# EAGLE design M_F_ext_breadboard (EAGLE 9.6.2)
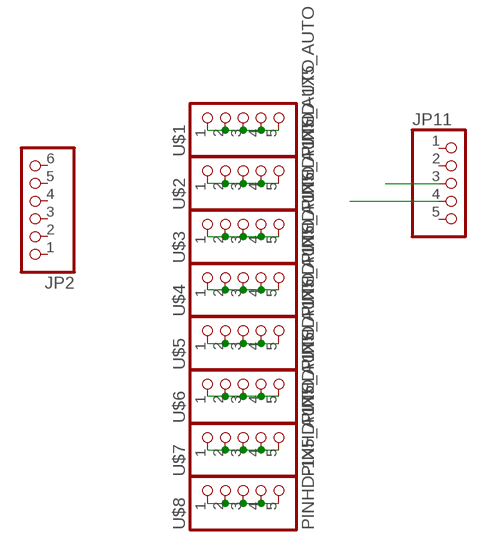
[diagram p0: schematic, sheet 1]

## Parts
JP2  PINHD-1X6  [1X06]
JP11  PINHD-1X5  [1X05]
U$1  PINHD-1X5_AUTO  [1X5_AUTO]
U$2  PINHD-1X5_AUTO  [1X5_AUTO]
U$3  PINHD-1X5_AUTO  [1X5_AUTO]
U$4  PINHD-1X5_AUTO  [1X5_AUTO]
U$5  PINHD-1X5_AUTO  [1X5_AUTO]
U$6  PINHD-1X5_AUTO  [1X5_AUTO]
U$7  PINHD-1X5_AUTO  [1X5_AUTO]
U$8  PINHD-1X5_AUTO  [1X5_AUTO]

## Nets
GND: JP11.4
N$1: U$1.1 U$1.2 U$1.3 U$1.4 U$1.5
N$2: U$2.1 U$2.2 U$2.3 U$2.4 U$2.5
N$3: U$3.1 U$3.2 U$3.3 U$3.4 U$3.5
N$4: U$4.1 U$4.2 U$4.3 U$4.4 U$4.5
N$5: U$5.1 U$5.2 U$5.3 U$5.4 U$5.5
N$6: U$6.1 U$6.2 U$6.3 U$6.4 U$6.5
N$7: U$7.1 U$7.2 U$7.3 U$7.4 U$7.5
N$8: U$8.1 U$8.2 U$8.3 U$8.4 U$8.5
VDD: JP11.3
Unconnected: JP2.1 JP2.2 JP2.3 JP2.4 JP2.5 JP2.6 JP11.1 JP11.2 JP11.5

## Library data of the parts
JP2 = pinhead2:PINHD-1X6: PIN HEADER
JP11 = pinhead2:PINHD-1X5: PIN HEADER
U$1-U$8 = pinhead2:PINHD-1X5_AUTO

## Board
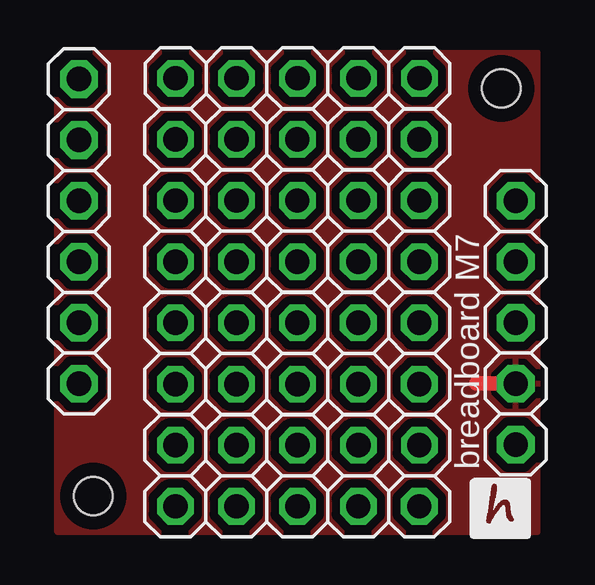
[diagram p1: board, top side]
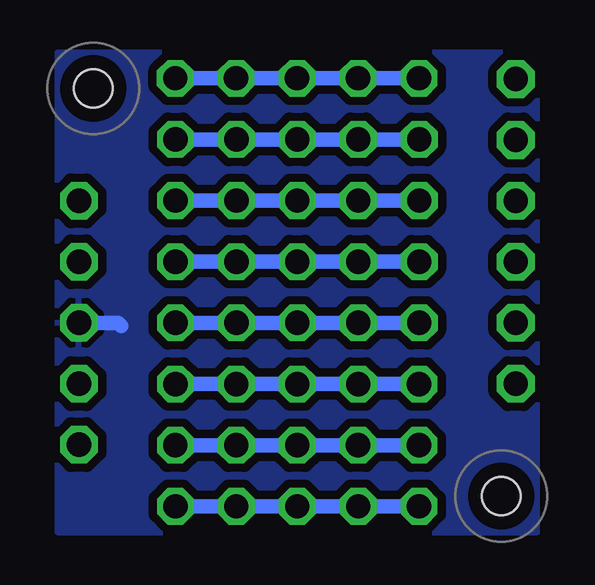
[diagram p2: board, bottom side, seen from below]

No outline drawn. Coordinates in mm, seen from the top.
Copper layers (1*16): Top 0.035mm / dielectric 1.5mm / Bottom 0.035mm
Design rules "default *": minimum track width 14mil, minimum drill 0.35mm, track to track 14mil, track to pad 13mil, pad to pad 14mil, via to via 14mil, smd to smd 14mil, copper to edge 15mil, drill to drill 15mil, minimum pad ring 10mil, minimum via ring 8mil, stop-mask expansion 4mil, vias tented up to drill 0mil, thermal gap 10mil
Holes 1.6 mm at 19,19 2,2
tRestrict: area 18,18 to 20,20; area 1,1 to 3,3
bRestrict: area 1,1 to 3,3; area 18,18 to 20,20

### Footprints (pad centres in the part's own frame; a part is rotated, then mirrored left to right if it is on the bottom)
1X06 = drill 1.016 pad 1.575 octagon: 1 -6.35,0; 2 -3.81,0; 3 -1.27,0; 4 1.27,0; 5 3.81,0; 6 6.35,0
1X05 = drill 1.016 pad 1.575 octagon: 1 -5.08,0; 2 -2.54,0; 3 0,0; 4 2.54,0; 5 5.08,0
1X5_AUTO = drill 1.016 octagon: 1 -5.08,0; 2 -2.54,0; 3 0,0; 4 2.54,0; 5 5.08,0

### Placement (x,y rotation side)
JP2  1.4,13.04 90 top
JP11  19.6,9.23 270 top
U$1  10.51,19.43 0 top
U$2  10.5,16.88 0 top
U$3  10.5,14.32 0 top
U$4  10.5,11.77 0 top
U$5  10.5,9.23 0 top
U$6  10.5,6.67 0 top
U$7  10.5,4.12 0 top
U$8  10.5,1.57 0 top

### Tracks (layer width: path | path; a pad name or v marks a point on that pad's centre or on a via)
GND
  Top 0.61: JP11.4 17.95,6.69
  pour Top (isolate 0.254): 0.5,20.5 20.5,20.5 20.5,0.5 0.5,0.5
N$1
  Bottom 0.61: U$1.1 U$1.2 U$1.3 U$1.4 U$1.5
N$2
  Bottom 0.61: U$2.5 U$2.4 U$2.3 U$2.2 U$2.1
N$3
  Bottom 0.61: U$3.1 U$3.2 U$3.3 U$3.4 U$3.5
N$4
  Bottom 0.61: U$4.5 U$4.4 U$4.3 U$4.2 U$4.1
N$5
  Bottom 0.61: U$5.1 U$5.2 U$5.3 U$5.4 U$5.5
N$6
  Bottom 0.61: U$6.5 U$6.4 U$6.3 U$6.2 U$6.1
N$7
  Bottom 0.61: U$7.1 U$7.2 U$7.3 U$7.4 U$7.5
N$8
  Bottom 0.61: U$8.5 U$8.4 U$8.3 U$8.2 U$8.1
VDD
  Bottom 0.61: JP11.3 17.97,9.23 17.83,9.09
  pour Bottom (isolate 0.254): 0.5,20.5 20.5,20.5 20.5,0.5 0.5,0.5

### Text on the board
tPlace: breadboard M7